# EAGLE design Pololu Magnetic Encoder (Floating) (AS5050) (EAGLE 6.4)
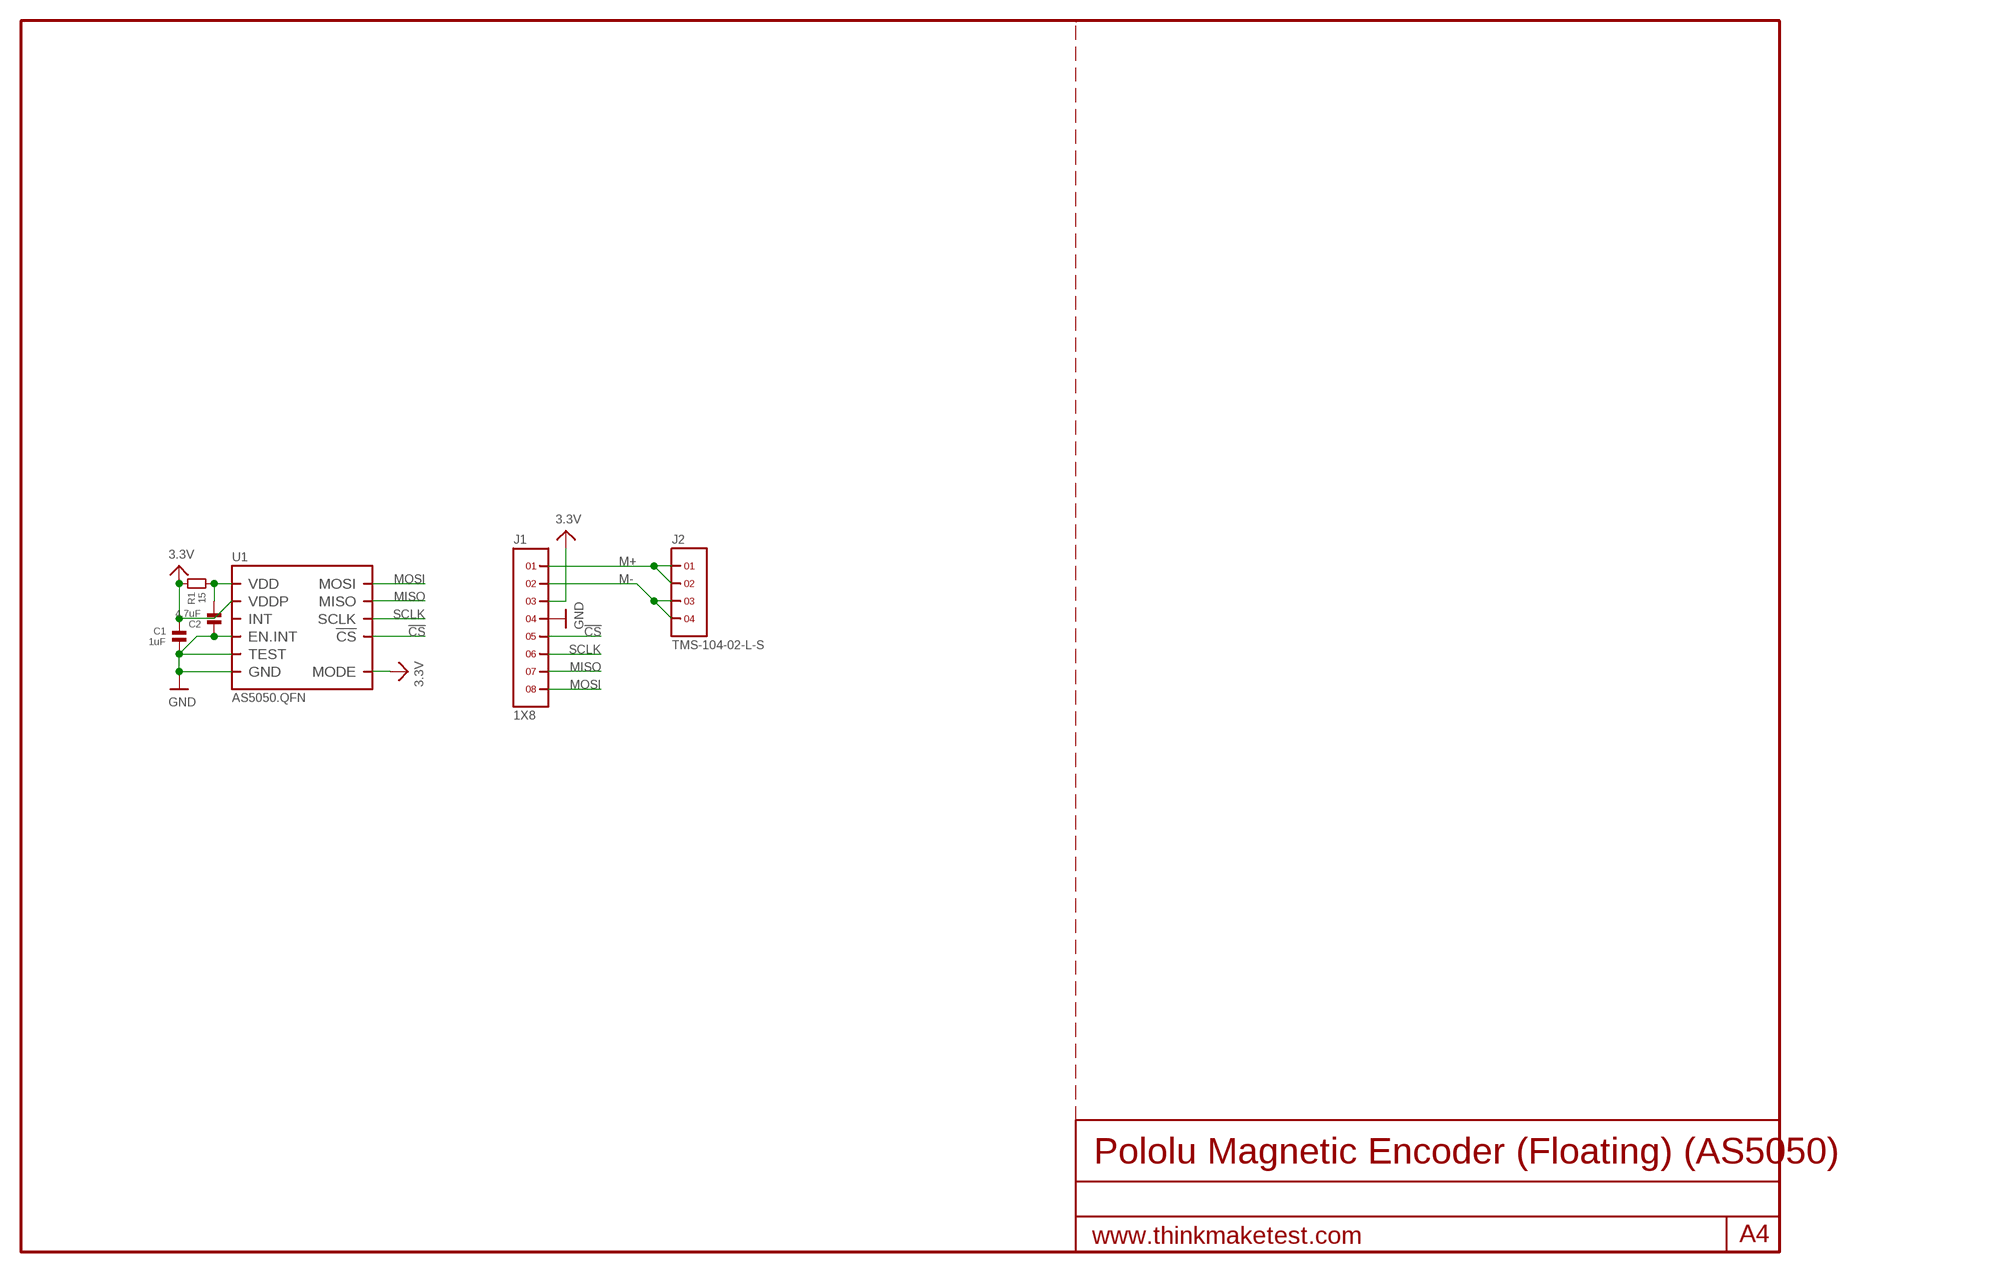
[diagram p0: schematic, sheet 1]

## Parts
C1  1uF  CAPACITOR.0603  [0603]
C2  4.7uF  CAPACITOR.0603  [0603]
J1  1X8  [1X8]
J2  TMS-104-02-L-S  1X4.LOCK  [1X4.LOCK]
R1  15  RESISTOR.0603  [0603]
U1  AS5050.QFN  [QFN.16]

## Nets
3.3V: C1.1 J1.3 R1.1 U1.11(VDDP) U1.14(MODE)
!CS: J1.5 U1.4(!CS)
GND: C1.2 C2.1 J1.4 U1.9(TEST) U1.10(EN.INT) U1.13(GND)
M+: J1.1 J2.1 J2.2
M-: J1.2 J2.3 J2.4
MISO: J1.7 U1.2(MISO)
MOSI: J1.8 U1.1(MOSI)
N$1: C2.2 R1.2 U1.12(VDD)
SCLK: J1.6 U1.3(SCLK)
Unconnected: U1.15(INT)

## Library data of the parts
C1 C2 = standardparts:CAPACITOR
J1 = headers(.05in):1X8
J2 = headers(.05in):1X4
R1 = standardparts:RESISTOR
U1 = austriamicrosystems:AS5050

## Board
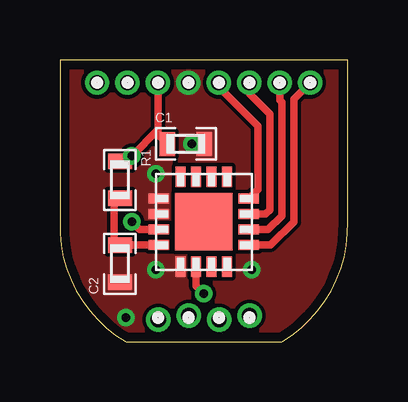
[diagram p1: board, top side]
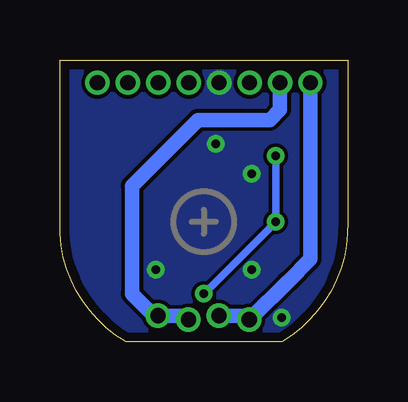
[diagram p2: board, bottom side, seen from below]

Size 12 x 11.75 mm. Coordinates in mm from the lower left corner, seen from the top.
Outline: 2.75,0 9.25,0 arc62 12,5 12,11.75 0,11.75 0,5 arc62 2.75,0
Copper layers (1*16): Top 0.0356mm / dielectric 1.5011mm / Bottom 0.0356mm
Design rules "OSHPark": minimum track width 6mil, minimum drill 13mil, track to track 6mil, track to pad 6mil, pad to pad 6mil, via to via 6mil, smd to smd 0mil, copper to edge 15mil, drill to drill 6mil, minimum pad ring 7mil, minimum via ring 7mil, stop-mask expansion 0mil, vias tented up to drill 16mil, thermal gap 10mil

### Footprints (pad centres in the part's own frame; a part is rotated, then mirrored left to right if it is on the bottom)
0603 = smd 0.65 x 1: 1 -0.775,0; 2 0.775,0
1X8 = drill 0.635 pad 1.016: 1 0,0; 2 1.27,0; 3 2.54,0; 4 3.81,0; 5 5.08,0; 6 6.35,0; 7 7.62,0; 8 8.89,0
1X4.LOCK = drill 0.635 pad 1.016: 1 0,-0.08; 2 1.27,0.08; 3 2.54,-0.08; 4 3.81,0.08
QFN.16 = smd 0.85 x 0.42: 1 -1.875,0.975; 2 -1.875,0.325; 3 -1.875,-0.325; 4 -1.875,-0.975; 9 1.875,-0.975; 10 1.875,-0.325; 11 1.875,0.325; 12 1.875,0.975 | smd 0.42 x 0.85: 5 -0.975,-1.875; 6 -0.325,-1.875; 7 0.325,-1.875; 8 0.975,-1.875; 13 0.975,1.875; 14 0.325,1.875; 15 -0.325,1.875; 16 -0.975,1.875 | smd 2.4 x 2.4: PAD 0,0

### Placement (x,y rotation side)
C1  5.25,8.25 0 top
C2  2.5,3.25 90 top
J1  1.55,10.8 0 top
J2  4.1,1 0 top
R1  2.5,6.75 270 top
U1  6,5 180 top

### Tracks (layer width: path | path; a pad name or v marks a point on that pad's centre or on a via)
3.3V  (via drill 0.36)
  Top 0.305: U1.11 3.33,4.67 v3,5 | 3.5,8.25 v3,7.75 | v3,7.75 2.77,7.53 R1.1 | U1.14 5.67,2.33 v6,2 | J1.3 4.09,9.25 4.09,8.84 | 4.09,8.84 v3,7.75 | C1.1 4.09,8.63 4.09,8.84
  Bottom 0.305: v3,7.75 v3,5 v6,2
!CS
  Top 0.305: U1.4 8.25,6.35 8.25,9 6.63,10.62 J1.5
GND  (via drill 0.36)
  other vias: 4,3 4,7 8,3 5.5,8.25 2.75,1
  pour Bottom (no thermals): 0,0 12,0 12,11.75 0,11.75
  pour Top (no thermals): 0,0 12,0 12,11.75 0,11.75
M+
  Bottom 0.61: J1.1 1.55,3.45 2.5,2.5 | 2.5,2.5 3.92,1.08 J2.2 | J2.1 2.52,2.5 2.5,2.5
M-
  Bottom 0.61: J1.2 2.82,9.68 3.25,9.25 6.25,9.25 9,6.5 9,2 8.08,1.08 J2.4 6.8,1.08 J2.3
MISO
  Top 0.305: U1.2 8.68,4.67 9.25,5.25 9.25,10 9.17,10.08 J1.7
MOSI
  Top 0.305: U1.1 8.78,4.03 9.75,5 9.75,10.11 J1.8
N$1
  Top 0.305: U1.12 C2.2 2.25,4.28 2.25,5.72 R1.2
SCLK
  Top 0.305: U1.3 8.57,5.33 8.75,5.5 8.75,9.5 7.9,10.35 J1.6

### Text on the board
tDocu: Cruz Monrreal II | AnomalousMaker.com
bDocu: M+ | M- | 3.3v | GND | !CS | SCLK | MISO | MOSI